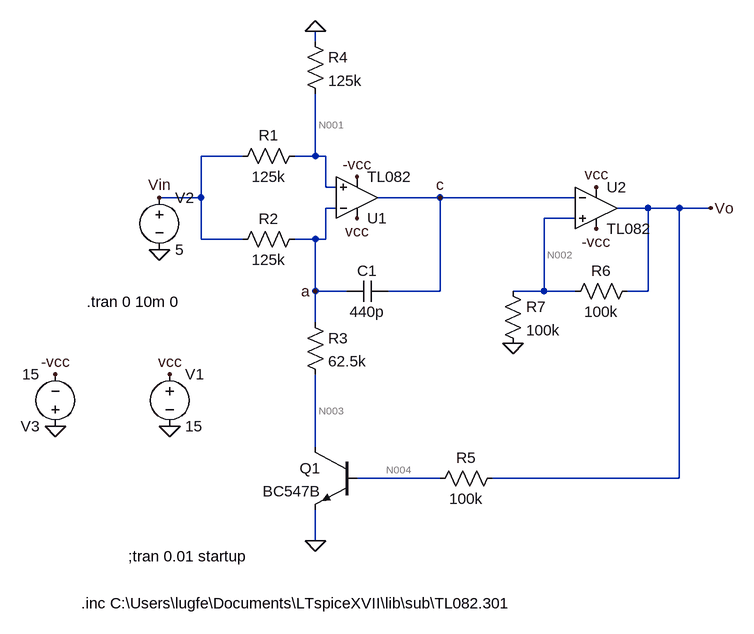
[diagram p0: schematic Draft2.asc]
Draft2.asc, the LTspice schematic file:
Version 4
SHEET 1 880 784
WIRE 192 -96 192 -112
WIRE 80 80 16 80
WIRE 192 80 192 -16
WIRE 192 80 160 80
WIRE 208 80 192 80
WIRE 208 128 208 80
WIRE 224 128 208 128
WIRE 16 144 16 80
WIRE 16 144 -48 144
WIRE 384 144 288 144
WIRE 592 144 384 144
WIRE 224 160 208 160
WIRE 704 160 656 160
WIRE 752 160 704 160
WIRE 800 160 752 160
WIRE 592 176 544 176
WIRE 16 208 16 144
WIRE 80 208 16 208
WIRE 192 208 160 208
WIRE 208 208 208 160
WIRE 208 208 192 208
WIRE 192 288 192 208
WIRE 240 288 192 288
WIRE 384 288 384 144
WIRE 384 288 304 288
WIRE 544 288 544 176
WIRE 544 288 496 288
WIRE 592 288 544 288
WIRE 704 288 704 160
WIRE 704 288 672 288
WIRE 192 336 192 288
WIRE 192 528 192 416
WIRE 384 576 256 576
WIRE 752 576 752 160
WIRE 752 576 464 576
WIRE 192 672 192 624
FLAG 192 -112 0
FLAG 192 672 0
FLAG -48 144 Vin
FLAG 800 160 Vo
FLAG 496 368 0
FLAG 256 176 vcc
FLAG 624 128 vcc
FLAG -32 416 vcc
FLAG -32 496 0
FLAG -48 224 0
FLAG 192 288 a
FLAG 384 144 c
FLAG -208 416 -vcc
FLAG -208 496 0
FLAG 256 112 -vcc
FLAG 624 192 -vcc
SYMBOL res 176 64 R90
WINDOW 0 0 56 VBottom 2
WINDOW 3 32 56 VTop 2
SYMATTR InstName R1
SYMATTR Value 125k
SYMBOL res 176 192 R90
WINDOW 0 0 56 VBottom 2
WINDOW 3 32 56 VTop 2
SYMATTR InstName R2
SYMATTR Value 125k
SYMBOL Opamps\\opamp2 256 208 M180
SYMATTR InstName U1
SYMATTR Value TL082
SYMBOL cap 304 272 R90
WINDOW 0 0 32 VBottom 2
WINDOW 3 32 32 VTop 2
SYMATTR InstName C1
SYMATTR Value 440p
SYMBOL res 176 320 R0
SYMATTR InstName R3
SYMATTR Value 62.5k
SYMBOL res 176 -112 R0
SYMATTR InstName R4
SYMATTR Value 125k
SYMBOL npn 256 528 M0
SYMATTR InstName Q1
SYMATTR Value BC547B
SYMBOL res 480 560 R90
WINDOW 0 0 56 VBottom 2
WINDOW 3 32 56 VTop 2
SYMATTR InstName R5
SYMATTR Value 100k
SYMBOL Opamps\\opamp2 624 96 R0
SYMATTR InstName U2
SYMATTR Value TL082
SYMBOL res 688 272 R90
WINDOW 0 0 56 VBottom 2
WINDOW 3 32 56 VTop 2
SYMATTR InstName R6
SYMATTR Value 100k
SYMBOL res 480 272 R0
SYMATTR InstName R7
SYMATTR Value 100k
SYMBOL voltage -32 400 R0
WINDOW 123 0 0 Left 0
WINDOW 39 0 0 Left 0
SYMATTR InstName V1
SYMATTR Value 15
SYMBOL voltage -48 128 R0
WINDOW 123 0 0 Left 0
WINDOW 39 0 0 Left 0
SYMATTR InstName V2
SYMATTR Value 5
SYMBOL voltage -208 512 R180
WINDOW 123 0 0 Left 0
WINDOW 39 0 0 Left 0
SYMATTR InstName V3
SYMATTR Value 15
TEXT -96 696 Left 2 !;tran 0.01 startup
TEXT -168 768 Left 2 !.inc C:\\Users\\lugfe\\Documents\\LTspiceXVII\\lib\\sub\\TL082.301
TEXT -160 304 Left 2 !.tran 0 10m 0

The netlist it stands for:
* Draft2.asc
R1 N001 Vin 125k
R2 a Vin 125k
XU1 N001 a vcc -vcc c TL082  ; pins In+ In- V+ V- OUT
C1 c a 440p
R3 a N003 62.5k
R4 0 N001 125k
Q1 N003 N004 0 0 BC547B
R5 Vo N004 100k
XU2 N002 c vcc -vcc Vo TL082  ; pins In+ In- V+ V- OUT
R6 Vo N002 100k
R7 N002 0 100k
V1 vcc 0 15
V2 Vin 0 5
V3 0 -vcc 15
.model NPN NPN
.model PNP PNP
.lib standard.bjt
;tran 0.01 startup
.inc C:\Users\lugfe\Documents\LTspiceXVII\lib\sub\TL082.301
.tran 0 10m 0
.backanno
.end

* Results of the author's LTspice run, read from the files saved beside the schematic
* Operating Point, zero values left out:
*   V(n001) = 2.5 V
*   V(vin) = 5 V
*   V(a) = 2.5 V
*   V(c) = 271.5 mV
*   V(-vcc) = -15 V
*   V(vcc) = 15 V
*   V(n003) = 1.25 V
*   V(n004) = 535.9 mV
*   V(vo) = 543 mV
*   V(n002) = 271.5 mV
*   Ic(Q1) = 20 µA
*   Ib(Q1) = 71.06 nA
*   Ie(Q1) = -20.07 µA
*   I(R7) = 2.715 µA
*   I(R6) = 2.715 µA
*   I(R5) = 71.06 nA
*   I(R4) = -20 µA
*   I(R3) = 20 µA
*   I(R2) = -20 µA
*   I(R1) = -20 µA
*   I(V3) = -28.39 mA
*   I(V2) = -40 µA
*   I(V1) = -28.39 mA
*   Ix(u1:1) = 47.56 pA
*   Ix(u1:2) = 47.56 pA
*   Ix(u1:3) = 14.19 mA
*   Ix(u1:4) = -14.19 mA
*   Ix(u1:5) = -45.33 pA
*   Ix(u2:1) = 45.33 pA
*   Ix(u2:2) = 45.33 pA
*   Ix(u2:3) = 14.19 mA
*   Ix(u2:4) = -14.19 mA
*   Ix(u2:5) = -2.786 µA
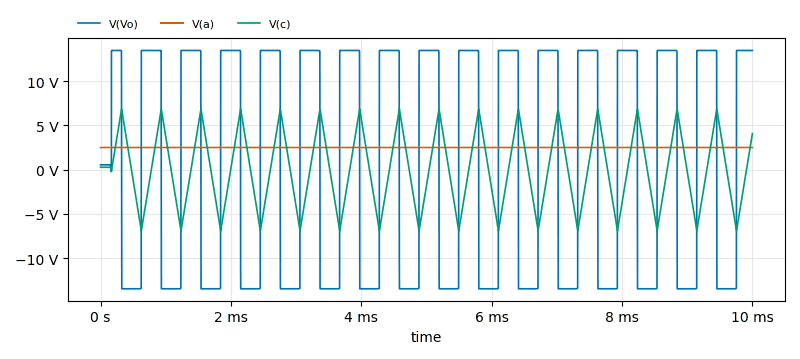
[diagram p1: Transient Analysis of Draft2.asc, plotted from the saved traces]
* Transient Analysis, 1 run:
*   V(Vo): min -13.48 V, max 13.49 V, average 205.5 mV, rms 13.33 V, last 13.48 V
*   V(a): min 2.496 V, max 2.504 V, average 2.5 V, rms 2.5 V, last 2.498 V
*   V(c): min -6.92 V, max 6.845 V, average 12.52 mV, rms 5.926 V, last 4.074 V